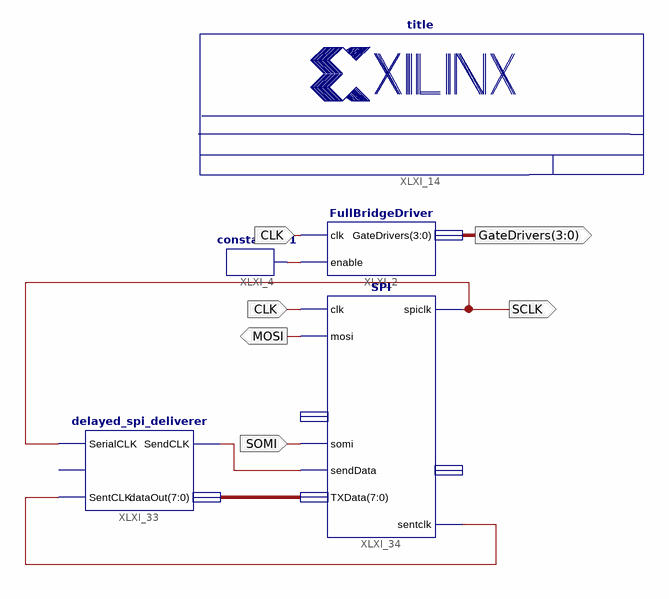
[diagram p0: schematic sheet 1]
// Xilinx ISE schematic PowerSupply.sch (spartan6) as structural Verilog: 5 symbols, 5 ports
module PowerSupply (
  input  CLK,
  input  SOMI,
  output [3:0] GateDrivers,
  output MOSI,
  output SCLK
);

  wire XLXN_3, XLXN_22, XLXN_23;
  wire [7:0] XLXN_19;

  FullBridgeDriver XLXI_2 (.clk(CLK), .GateDrivers(GateDrivers), .enable(XLXN_3));
  constant #(.CValue("1")) XLXI_4 (.O(XLXN_3));
  title XLXI_14 ();
  delayed_spi_deliverer XLXI_33 (
    .SerialCLK(SCLK), .SentCLK(XLXN_22), .SendCLK(XLXN_23), .dataOut(XLXN_19));  // open: ReceiveCLK
  SPI XLXI_34 (
    .clk(CLK), .somi(SOMI), .sendData(XLXN_23), .TXData(XLXN_19), .spiclk(SCLK), .mosi(MOSI),
    .sentclk(XLXN_22));  // open: value, RXData
endmodule
